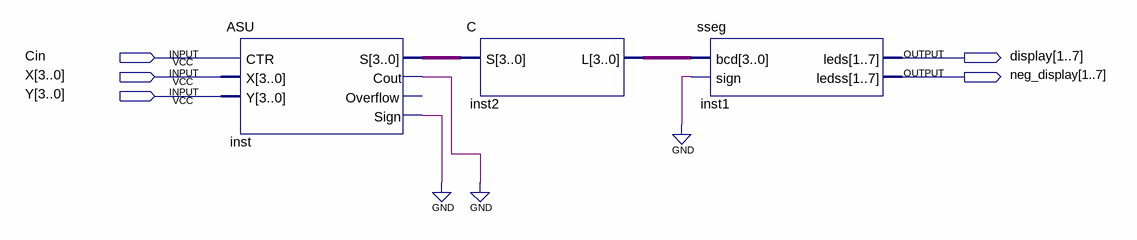
[diagram p0: schematic sheet]
// Quartus schematic CombinedASU2.bdf as structural Verilog: 3 symbols, 5 pins
module CombinedASU2 (
  input  Cin,
  input  [3:0] X,
  input  [3:0] Y,
  output [1:7] display,
  output [1:7] neg_display
);

  wire inst_cout, inst_sign;
  wire [3:0] inst2_l, inst_s;

  ASU inst (.CTR(Cin), .X(X), .Y(Y), .S(inst_s), .Cout(inst_cout), .Sign(inst_sign));  // open: Overflow
  C inst2 (.S(inst_s), .L(inst2_l));
  sseg inst1 (.bcd(inst2_l), .sign(1'b0), .leds(display), .ledss(neg_display));
  // also tied to GND on the sheet: {inst_sign, inst_cout}
endmodule
